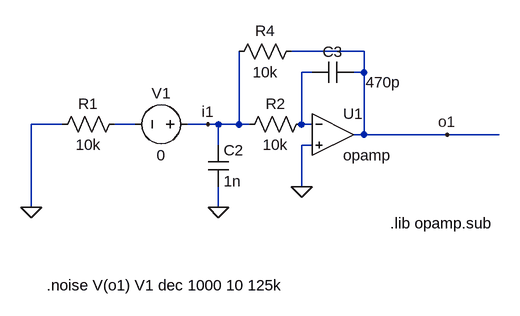
[diagram p0: schematic filtro ruido o1.asc]
filtro ruido o1.asc, the LTspice schematic file:
Version 4
SHEET 1 1900 680
WIRE -1616 -992 -1728 -992
WIRE -1696 -960 -1712 -960
WIRE -1616 -960 -1616 -992
WIRE -1616 -960 -1632 -960
WIRE -2080 -880 -2128 -880
WIRE -1968 -880 -2000 -880
WIRE -1856 -880 -1888 -880
WIRE -1840 -880 -1856 -880
WIRE -1808 -880 -1808 -992
WIRE -1808 -880 -1840 -880
WIRE -1792 -880 -1808 -880
WIRE -1712 -880 -1712 -960
WIRE -1696 -880 -1712 -880
WIRE -1616 -864 -1616 -960
WIRE -1616 -864 -1632 -864
WIRE -1488 -864 -1616 -864
WIRE -1408 -864 -1488 -864
WIRE -1840 -848 -1840 -880
WIRE -1696 -848 -1712 -848
WIRE -1712 -784 -1712 -848
WIRE -2128 -752 -2128 -880
WIRE -1840 -752 -1840 -784
FLAG -1712 -784 0
FLAG -1840 -752 0
FLAG -2128 -752 0
FLAG -1488 -864 o1
FLAG -1856 -880 i1
SYMBOL res -2096 -864 R270
WINDOW 0 32 56 VTop 2
WINDOW 3 0 56 VBottom 2
SYMATTR InstName R1
SYMATTR Value 10k
SYMBOL cap -1856 -848 R0
SYMATTR InstName C2
SYMATTR Value 1n
SYMBOL res -1808 -864 R270
WINDOW 0 32 56 VTop 2
WINDOW 3 0 56 VBottom 2
SYMATTR InstName R2
SYMATTR Value 10k
SYMBOL res -1824 -976 R270
WINDOW 0 32 56 VTop 2
WINDOW 3 0 56 VBottom 2
SYMATTR InstName R4
SYMATTR Value 10k
SYMBOL cap -1696 -944 R270
WINDOW 0 32 32 VTop 2
WINDOW 3 16 110 VBottom 2
SYMATTR InstName C3
SYMATTR Value 470p
SYMBOL Opamps\\opamp -1664 -928 R0
SYMATTR InstName U1
SYMBOL voltage -1872 -880 R90
WINDOW 0 -32 56 VBottom 2
WINDOW 3 32 56 VTop 2
SYMATTR InstName V1
SYMATTR Value 0
TEXT -1576 -728 Left 2 !.lib opamp.sub
TEXT -2104 -632 Left 2 !.noise V(o1) V1 dec 1000 10 125k

The netlist it stands for:
* filtro ruido o1.asc
R1 0 N002 10k
C2 i1 0 1n
R2 i1 N001 10k
R4 i1 o1 10k
C3 N001 o1 470p
XU1 N001 0 o1 opamp Aol=100K GBW=10Meg  ; pins invin noninvin out
V1 i1 N002 0
.lib opamp.sub
.noise V(o1) V1 dec 1000 10 125k
.backanno
.end